# EAGLE design ATTAMI-Shield-charge (EAGLE 7.1.0)
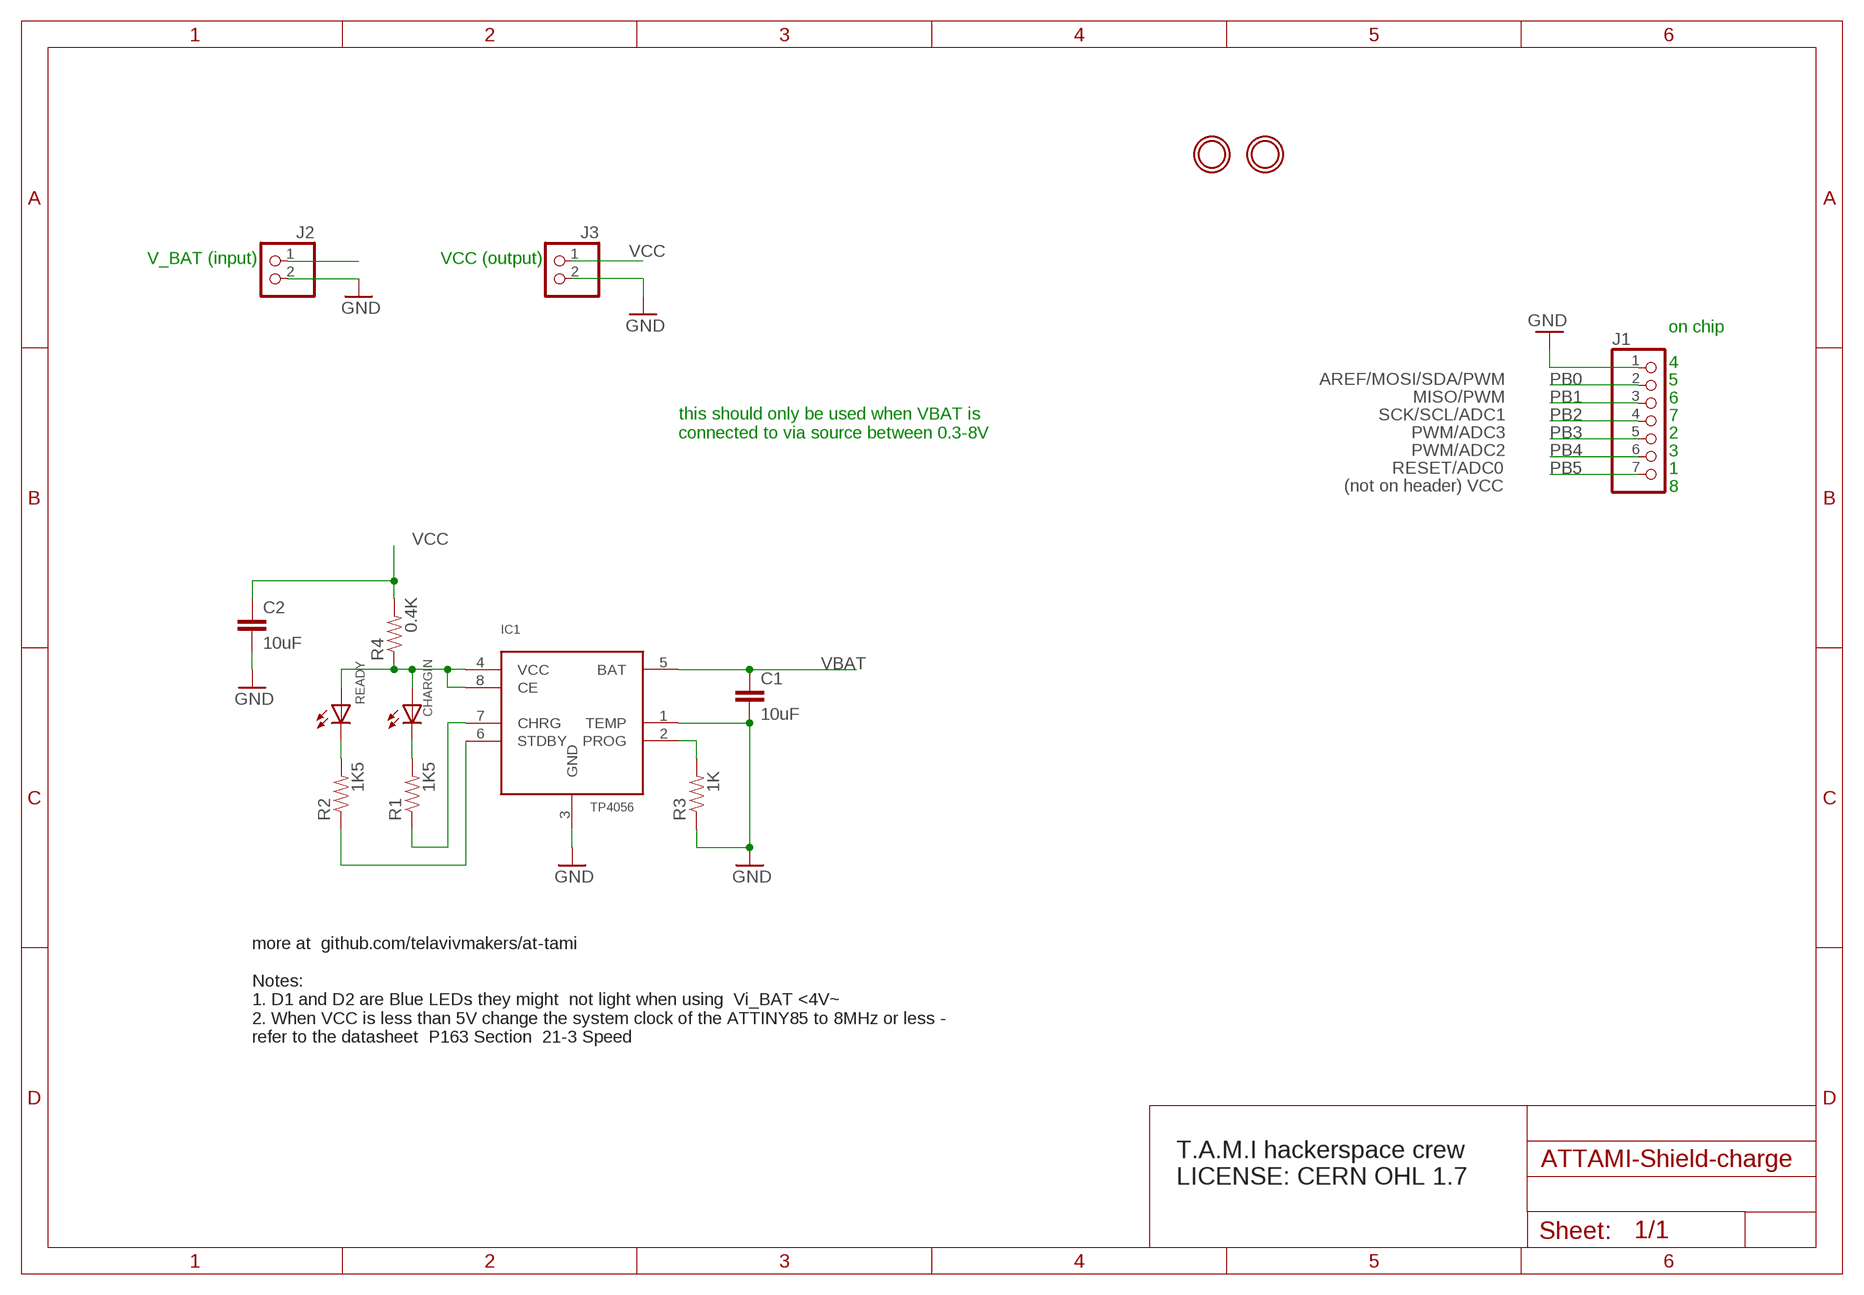
[diagram p0: schematic, sheet 1]

## Parts
C1  10uF  CAP0805  [0805]
C2  10uF  CAP0805  [0805]
CHARGIN  LED-0805  [LED-805]
IC1  TP4056  [SOP-8]
J1  HEADER-1X7ROUND  [1X07_ROUND]
J2  HEADER-1X2ROUND  [1X02_ROUND]
J3  HEADER-1X2ROUND  [1X02_ROUND]
R1  1K5  RESISTOR0805-RES  [0805]
R2  1K5  RESISTOR0805-RES  [0805]
R3  1K  RESISTOR0805-RES  [0805]
R4  0.4K  RESISTOR0805-RES  [0805]
READY  LED-0805  [LED-805]
U$1  MOUNTINGHOLE2.0  [MOUNTINGHOLE_2.0_PLATED]
U$2  MOUNTINGHOLE2.0  [MOUNTINGHOLE_2.0_PLATED]

## Nets
$02: CHARGIN.A IC1.4(VCC) IC1.8(CE) R4.1 READY.A
GND: C1.2 C2.2 IC1.1(TEMP) IC1.3(GND) J1.1 J2.2 J3.2 R3.1
N$3: IC1.2(PROG) R3.2
N$4: R2.2 READY.C
N$5: CHARGIN.C R1.2
N$6: IC1.6(STDBY) R2.1
N$7: IC1.7(CHRG) R1.1
PB0: J1.2
PB1: J1.3
PB2: J1.4
PB3: J1.5
PB4: J1.6
PB5: J1.7
VBAT: C1.1 IC1.5(BAT) J2.1
VCC: C2.1 J3.1 R4.2

## Notes on the sheet
- V_BAT (input) | VCC (output)
- AREF/MOSI/SDA/PWM
- MISO/PWM
- SCK/SCL/ADC1
- this should only be used when VBAT is 
  connected to via source between 0.3-8V
- PWM/ADC3
- PWM/ADC2
- RESET/ADC0
- (not on header) VCC
- on chip
  
  4
  5
  6
  7
  2
  3
  1
  8
- more at  github.com/telavivmakers/at-tami
  
  Notes: 
  1. D1 and D2 are Blue LEDs they might  not light when using  Vi_BAT <4V~  
  2. When VCC is less than 5V change the system clock of the ATTINY85 to 8MHz or less - 
  refer to the datasheet  P163 Section  21-3 Speed
- T.A.M.I hackerspace crew 
  LICENSE: CERN OHL 1.7

## Library data of the parts
C1 C2 = ATtami:CAP: Capacitor Standard 0603 ceramic capacitor, and 0.1" leaded capacitor.
CHARGIN READY = ATtami:LED: Light Emitting Diode
IC1 = ATtami:TP4056
J1 = ATtami:HEADER-1X7: PIN HEADER
J2 J3 = ATtami:HEADER-1X2: PIN HEADER
R1-R4 = ATtami:RESISTOR: Resistor Basic schematic elements and footprints for 0603, 1206, and PTH resistors.
U$1 U$2 = ATtami:MOUNTINGHOLE: Mounting Hole For #2 screws (0.086"/2.18mm width, 0.094"/2.4mm hole) use 2.5mm

## Net classes
0 default: width 0.203 mm
1 vcc: width 0.254 mm

## Board
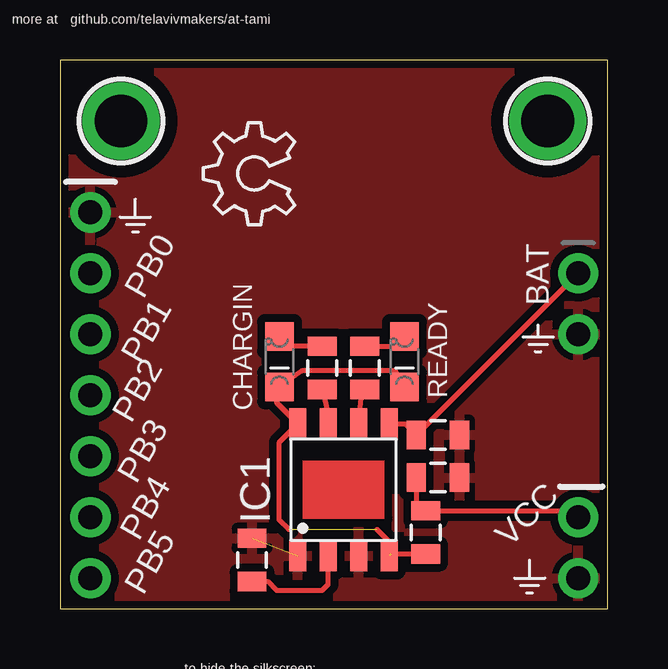
[diagram p1: board, top side]
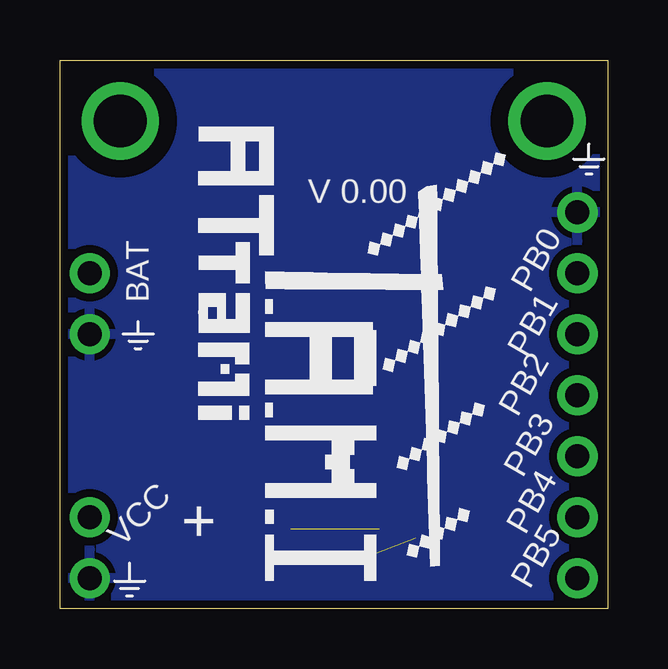
[diagram p2: board, bottom side, seen from below]

Size 22.83 x 22.86 mm. Coordinates in mm from the lower left corner, seen from the top.
Outline: 0,0 22.83,0 22.83,22.86 0,22.86 0,0
Copper layers (1*16): Top 0.035mm / dielectric 1.5mm / Bottom 0.035mm
Design rules "dirt_cheap_dirty_boards.v1": minimum track width 5mil, minimum drill 12mil, track to track 5mil, track to pad 5mil, pad to pad 5mil, via to via 5mil, smd to smd 0mil, copper to edge 10mil, drill to drill 10mil, minimum pad ring 10mil, minimum via ring 6mil, stop-mask expansion 2mil, vias tented up to drill 25mil, thermal gap 10mil

### Footprints (pad centres in the part's own frame; a part is rotated, then mirrored left to right if it is on the bottom)
0805 = smd 0.8 x 1.2: 1 -0.9,0; 2 0.9,0
LED-805 = smd 1.2 x 1.2: A 0,-1.05; C 0,1.05
SOP-8 = smd 1.3 x 0.7: 1 -2.75,1.905; 2 -2.75,0.635; 3 -2.75,-0.635; 4 -2.75,-1.905; 5 2.75,-1.905; 6 2.75,-0.635; 7 2.75,0.635; 8 2.75,1.905
1X07_ROUND = drill 1 pad 1.676: 1 -7.62,0; 2 -5.08,0; 3 -2.54,0; 4 0,0; 5 2.54,0; 6 5.08,0; 7 7.62,0
1X02_ROUND = drill 1 pad 1.676: 1 -1.27,0; 2 1.27,0
MOUNTINGHOLE_2.0_PLATED = drill 2.2 pad 3: P$1 0,0

### Placement (x,y rotation side)
C1  15.75,7.24 0 top
C2  15.75,5.46 0 top
CHARGIN  9.14,10.29 0 top
IC1  11.81,4.95 90 top
J1  1.27,8.89 270 top
J2  21.59,12.7 270 top
J3  21.59,2.54 270 top
R1  10.92,10.03 90 top
R2  12.7,10.03 90 top
R3  8,2.03 270 top
R4  15.24,3.17 90 top
READY  14.35,10.29 0 top
U$1  2.54,20.32 270 top
U$2  20.32,20.32 0 top
U$3  [OSHW_6X150_NOTEXT]  9.78,16 90 top

### Tracks (layer width: path | path; a pad name or v marks a point on that pad's centre or on a via)
$02  (2 unrouted)
  Top 0.203: R4.1 13.79,2.27 13.79,2.72 13.21,3.3 | READY.A 14.22,9.53 13.97,9.91 10.07,9.91 CHARGIN.A 9.02,8.59 IC1.8 9.14,6.94 9.14,3.68 9.53,3.3
GND  (1 unrouted)
  pour Bottom (isolate 0.33): 23.37,23.75 -1.52,23.62 -1.21,-1.43 23.37,-1.02
  pour Top (isolate 0.33): -1.02,23.5 -1.02,-0.51 23.62,-0.51 23.3,23.53
N$3
  Top 0.203: R3.2 8.65,1.13 9.02,0.76 10.92,0.76 11.18,1.02 IC1.2
N$4
  Top 0.203: R2.2 14.2,10.93 READY.C
N$5
  Top 0.203: R1.2 9.29,10.93 CHARGIN.C
N$6
  Top 0.203: IC1.6 12.57,9.01 R2.1
N$7
  Top 0.203: R1.1 11.18,8.08 IC1.7
VBAT
  Top 0.203: 14.77,7.7 C1.1 | C1.1 15.1,7.48 J2.1 | IC1.5 14.38,7.7 C1.1
VCC
  Top 0.203: C2.1 14.85,4.34 R4.2 21.32,4.08 J3.1

### Text on the board
tPlace: more at github.com/telavivmakers/at-tami | to hide the silkscreen: / disable layers: tNames, bNames, tPlace, bPlace
bPlace: V 0.00 | BAT | PB0 | PB1 | PB2 | PB3 | PB4 | + | VCC | PB5
tNames: BAT | PB0 | PB1 | PB2 | PB3 | PB4 | VCC | PB5
tTest: J2